# Altium schematic sheet Sheet1.SchDoc
size A1; PageSetup: Record=PageOptions|CenterHorizontal=True|CenterVertical=True|PrintScale=1.00|XCorrection=1.00|YCorrection=1.00|PrintKind=1|BorderSize=5000000|LeftOffset=0|BottomOffset=0|Orientation=2|PaperLength=1000|PaperWidth=1000|Scale=100|PaperSource=7|PrintQuality=-3|MediaType=1|DitherType=10|PrintScaleMode=1|PaperKind=A3 (Scaled)|PaperIndex=8
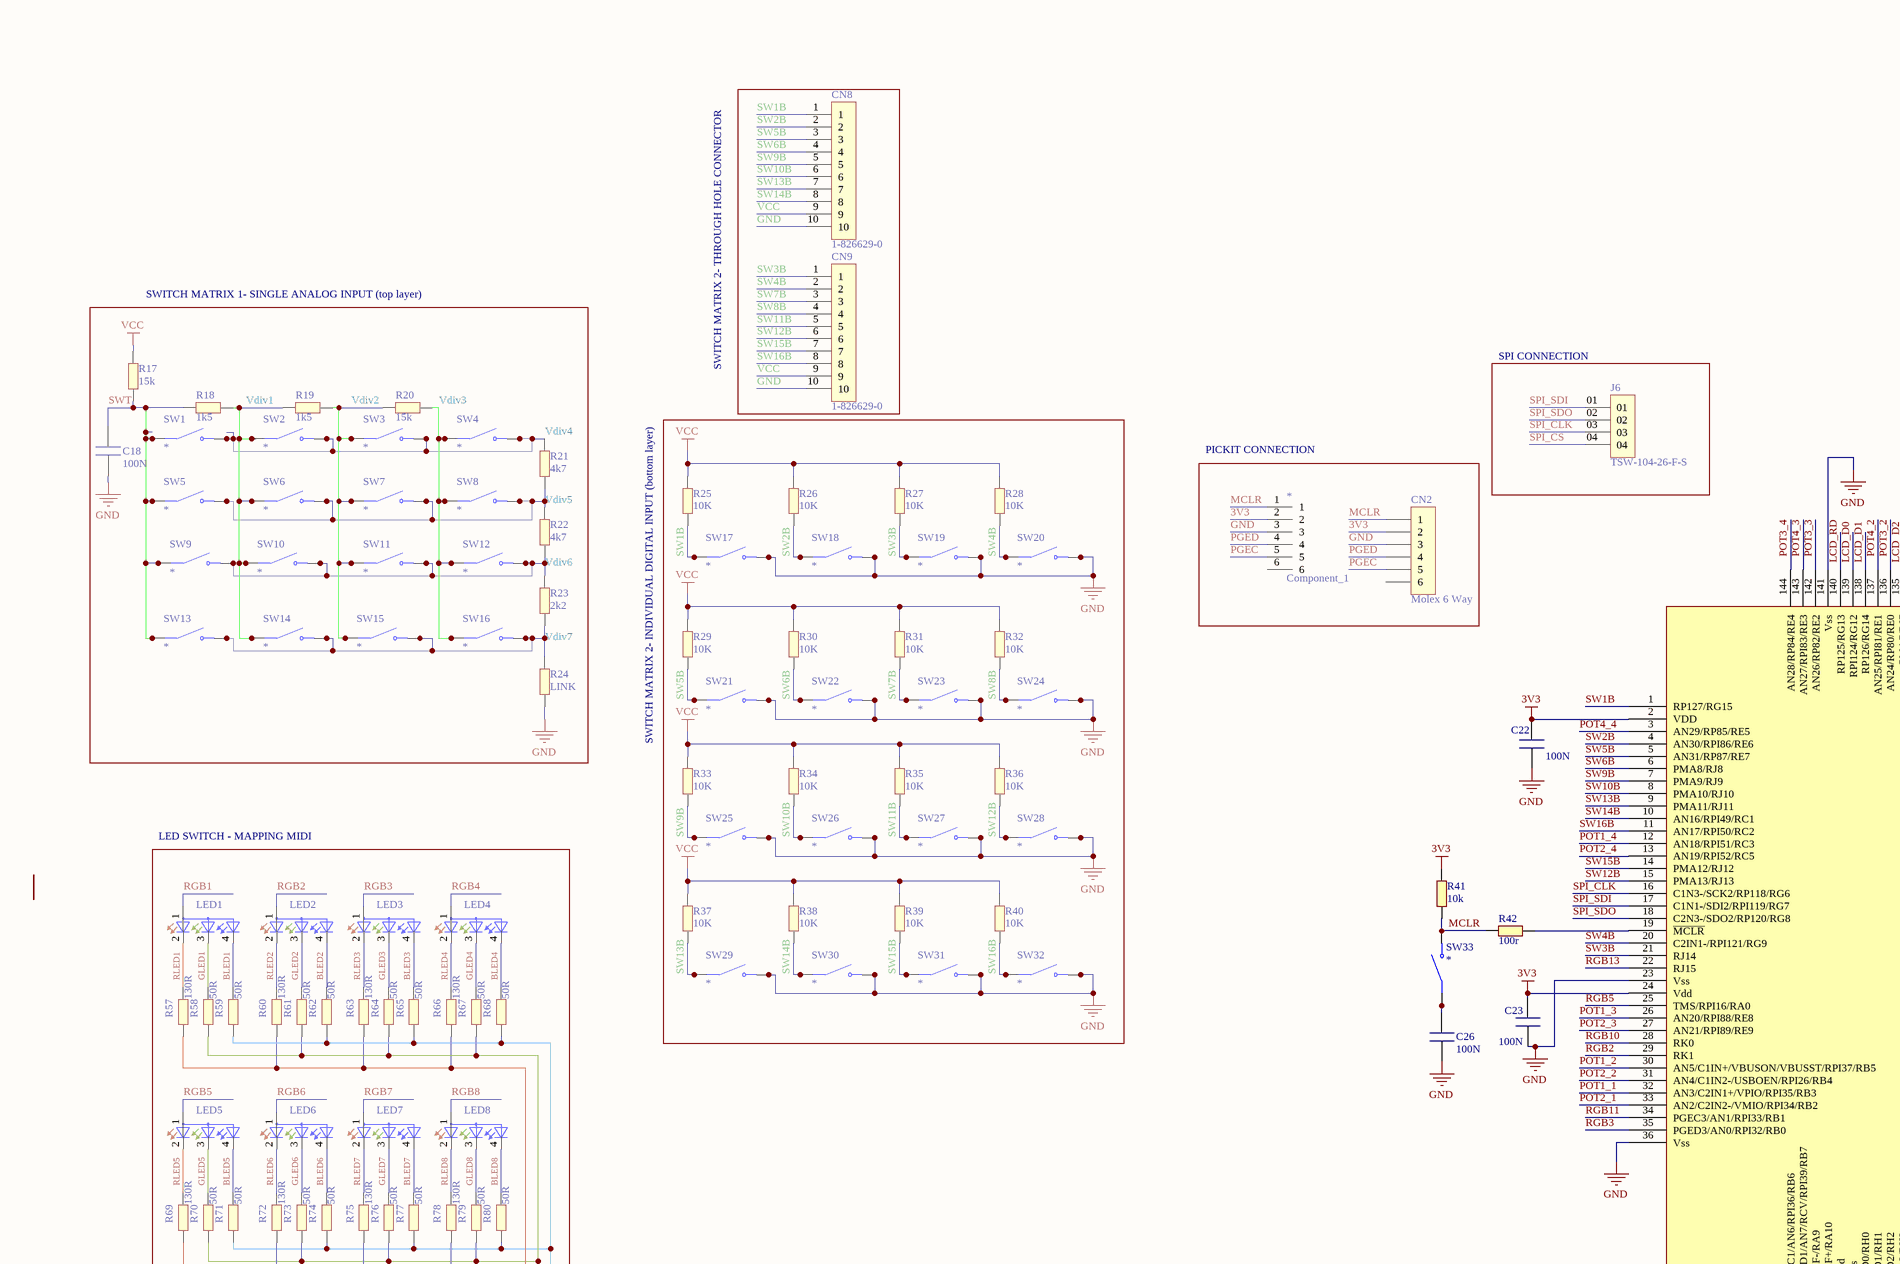
[diagram p0: Sheet1.SchDoc, top left]
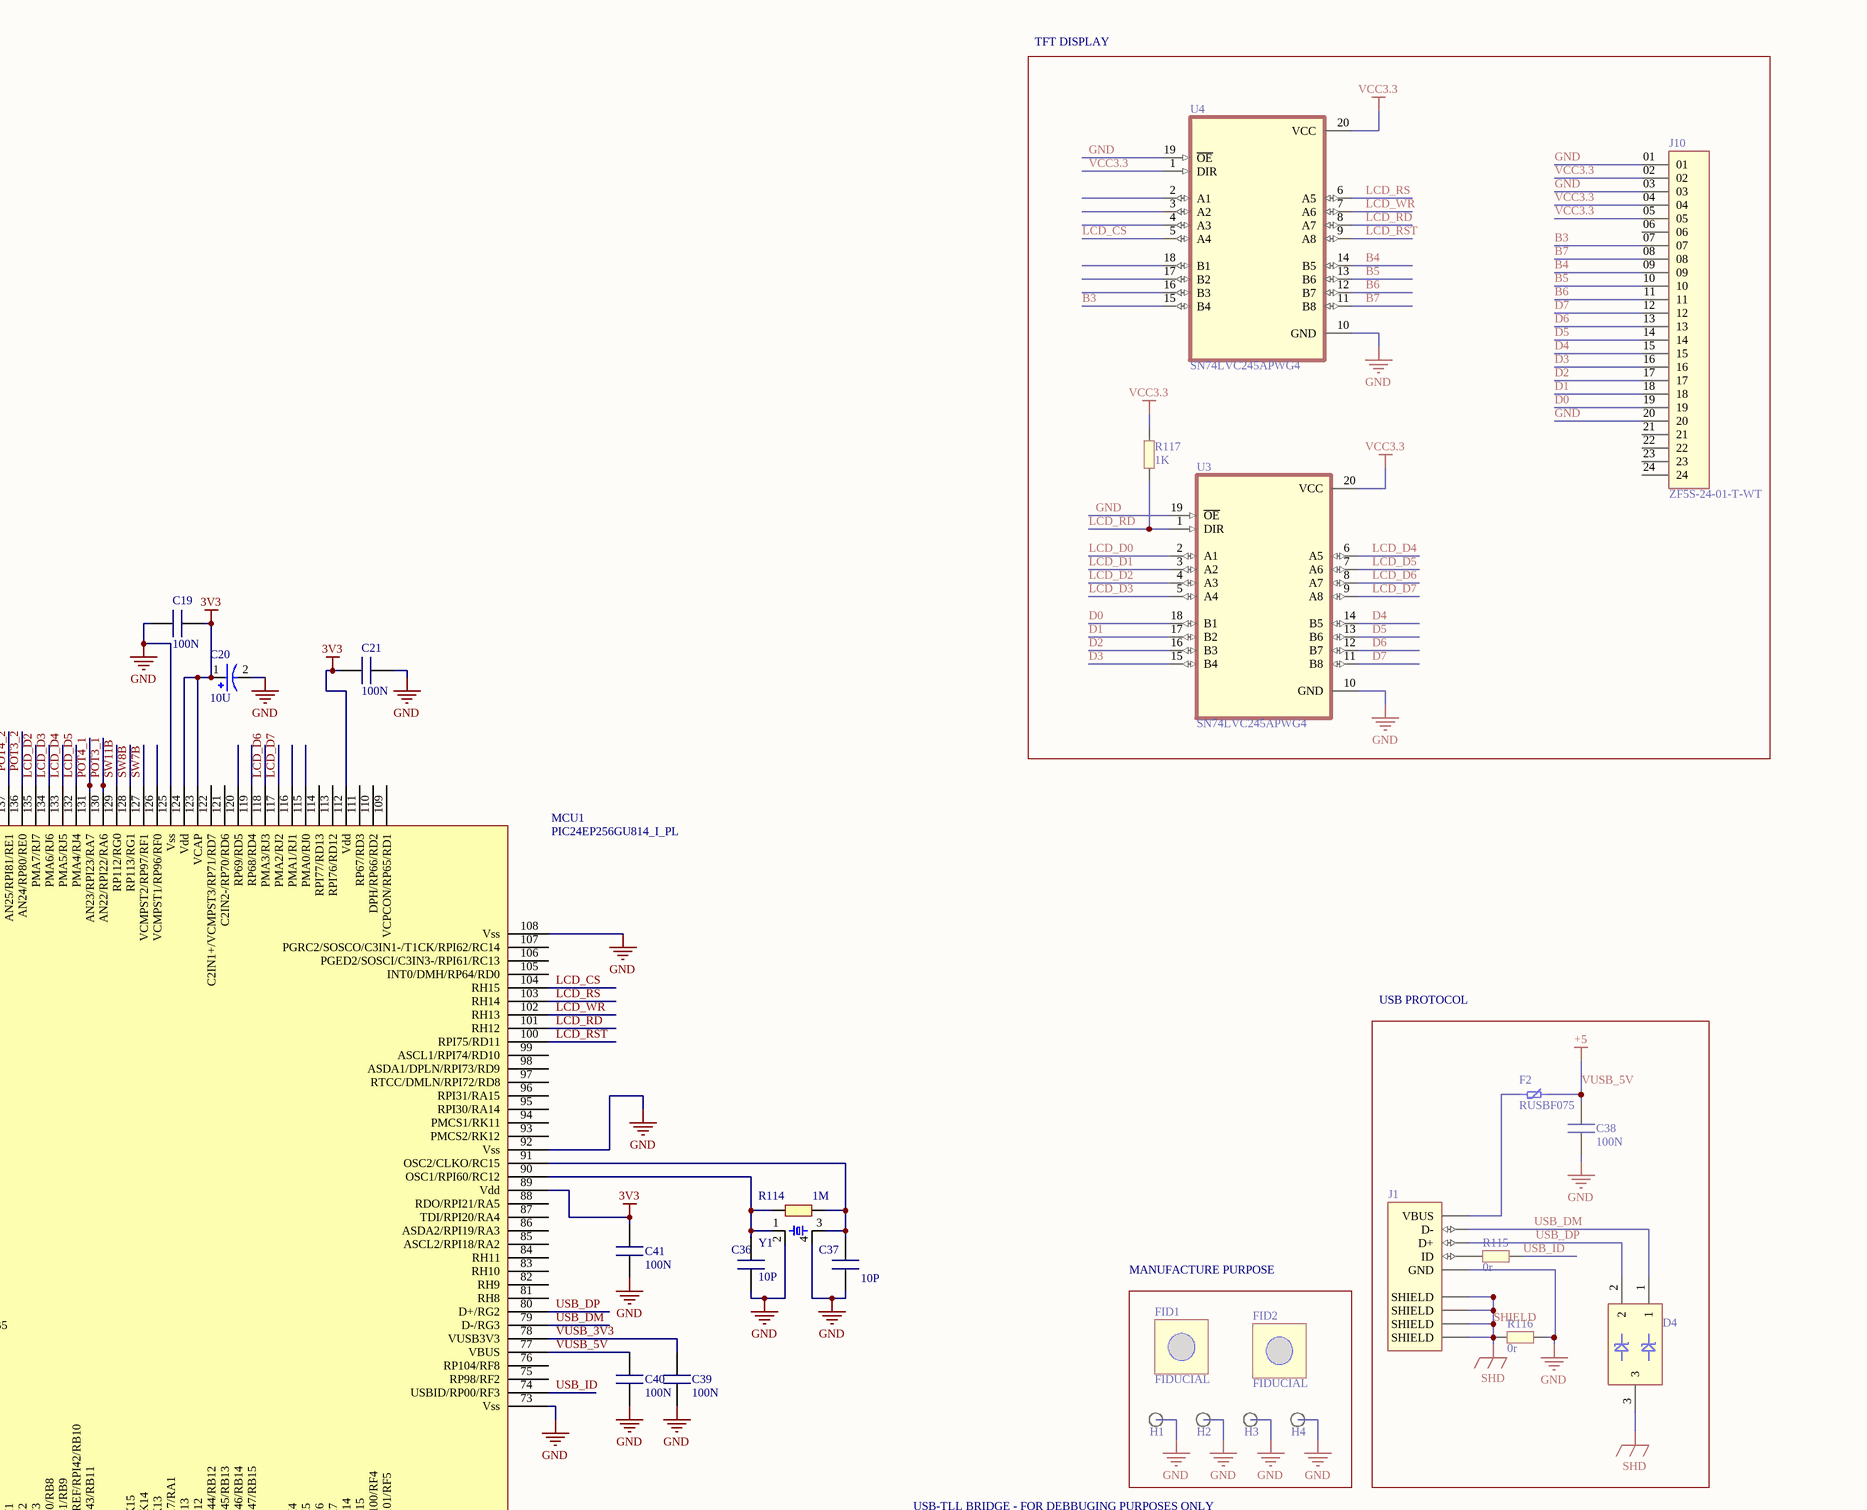
[diagram p1: Sheet1.SchDoc, top right]
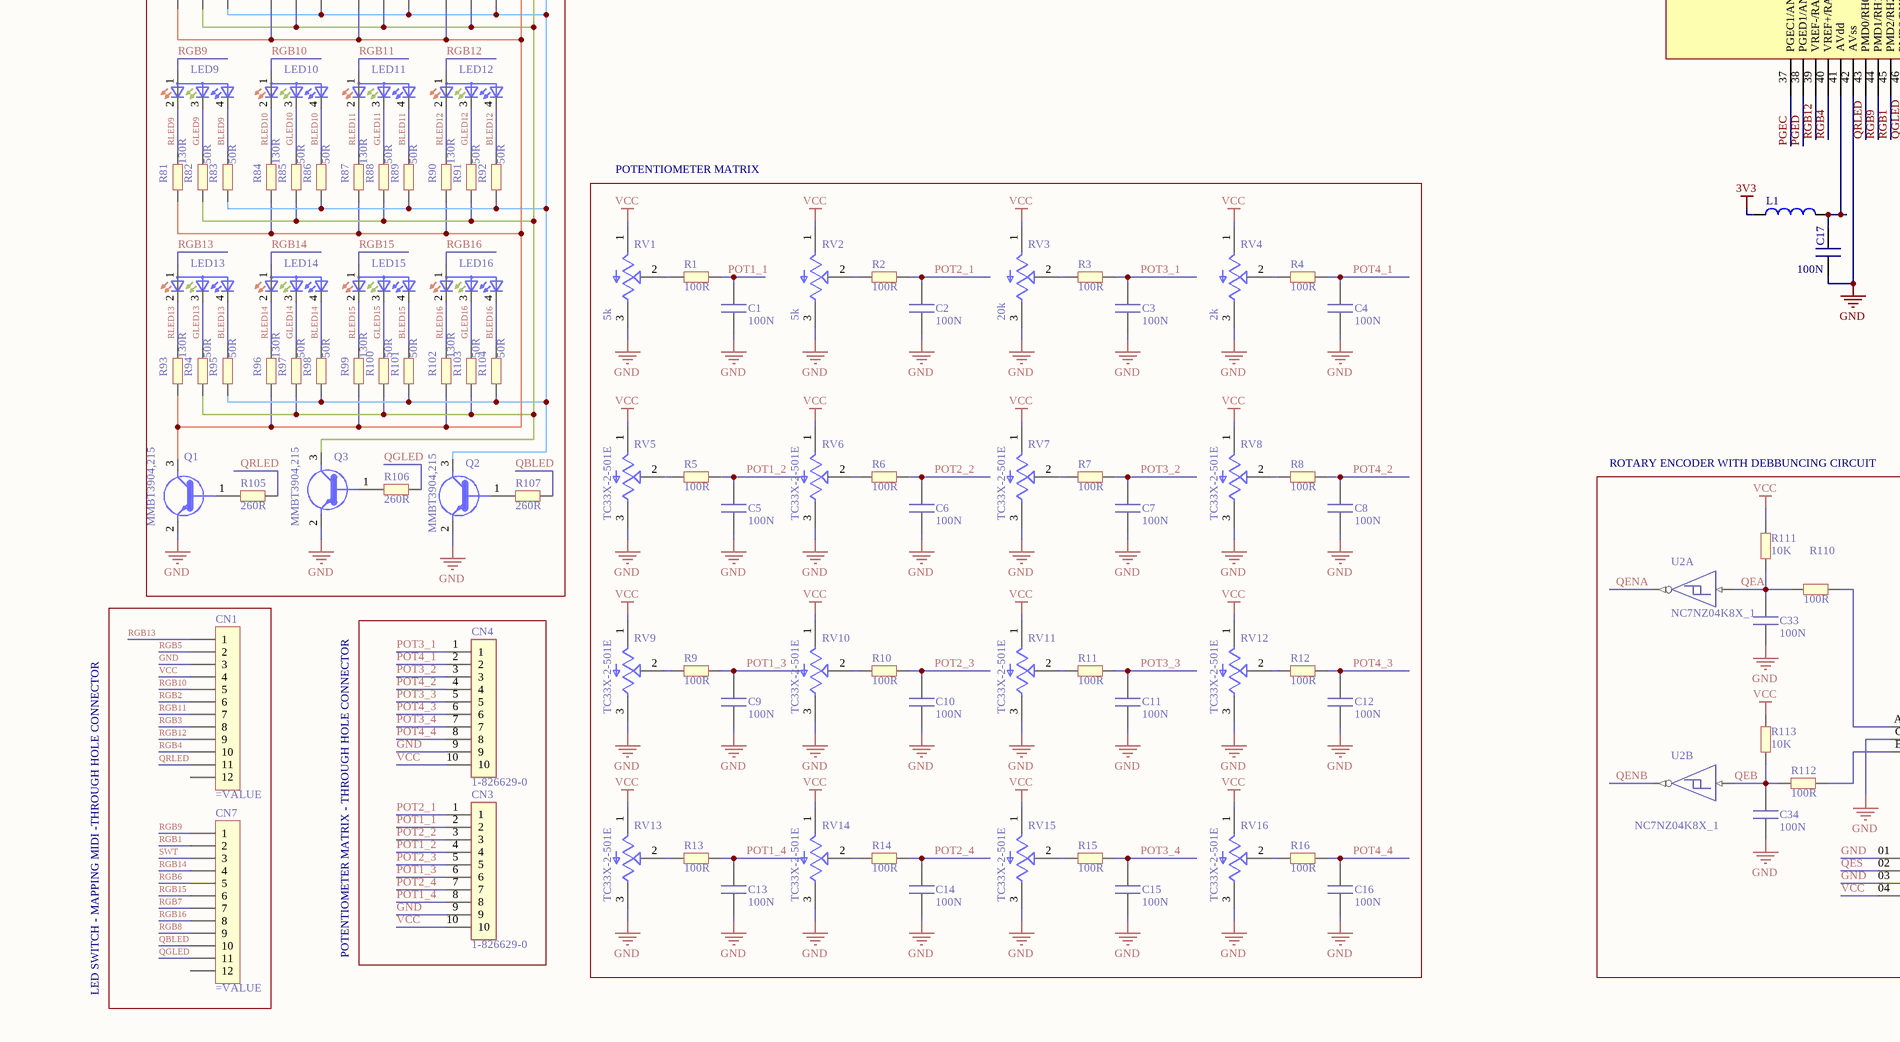
[diagram p2: Sheet1.SchDoc, bottom left]
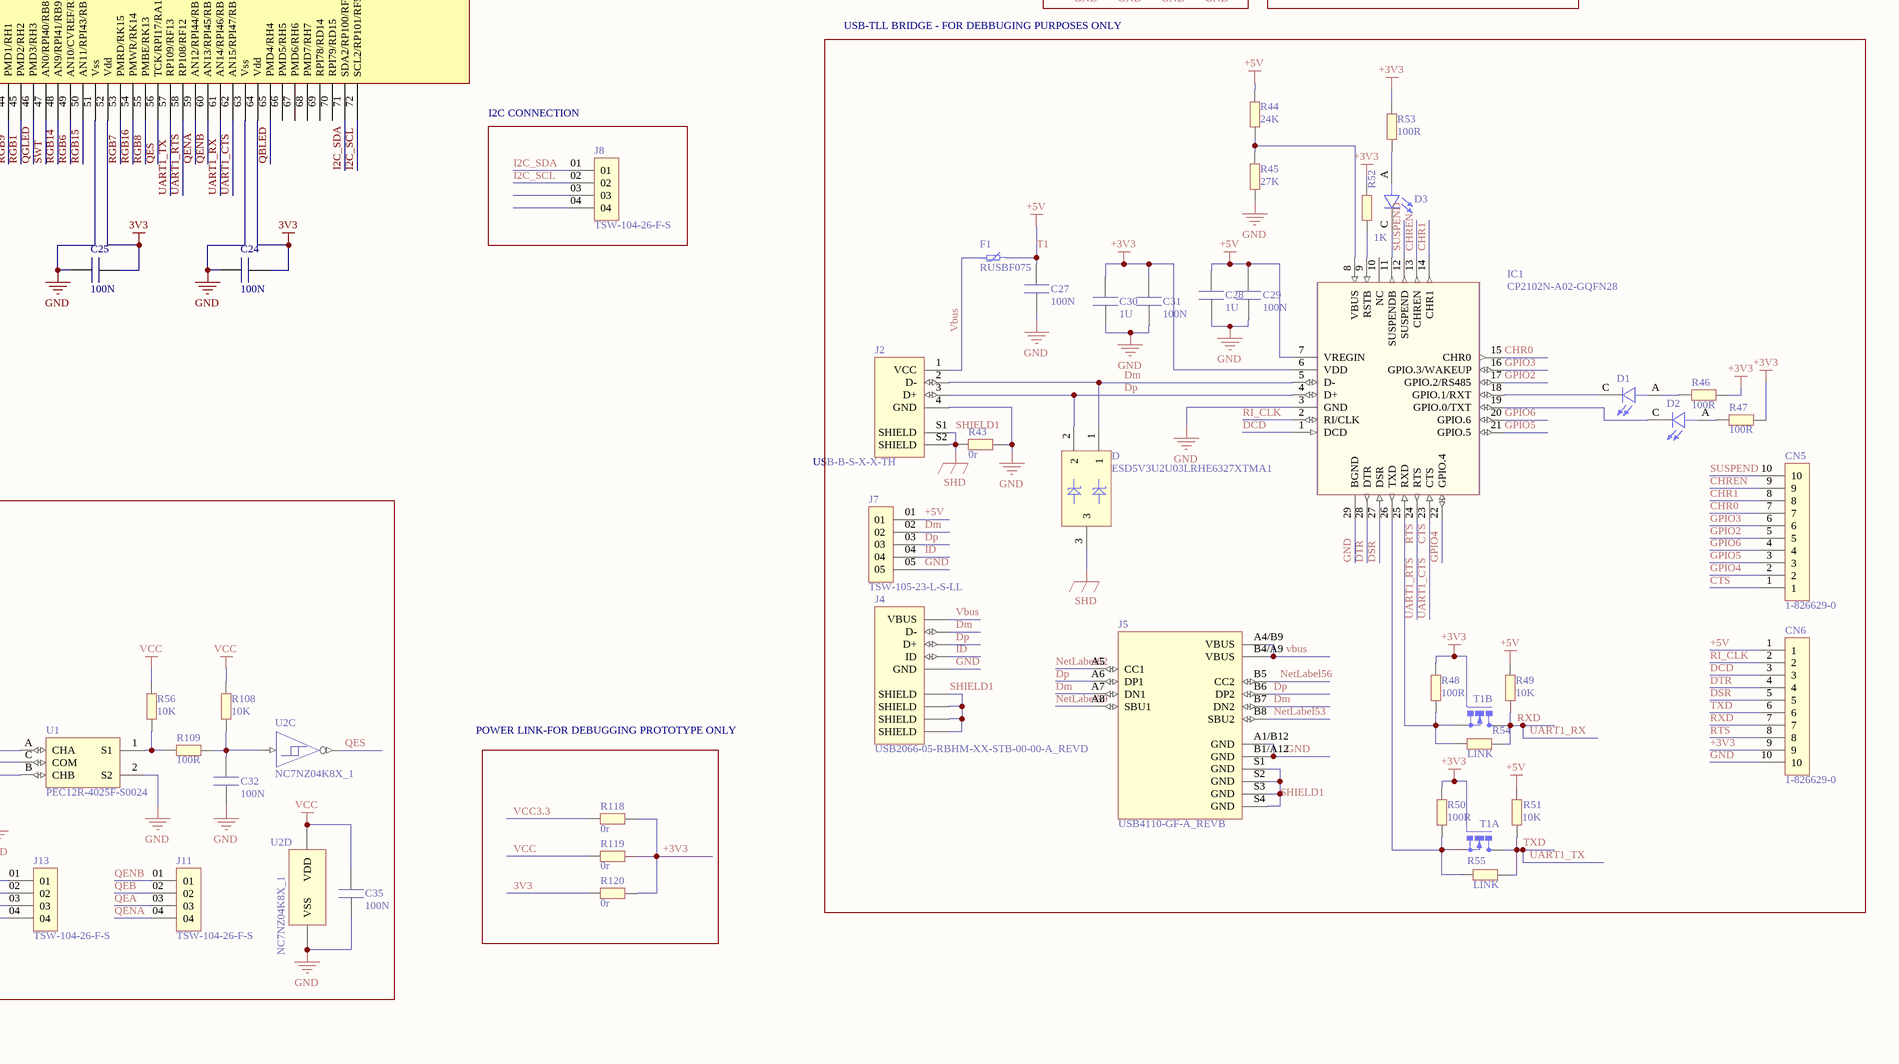
[diagram p3: Sheet1.SchDoc, bottom right]

## Parts
*  Component_1  [0.5_7 - duplicate]
C1  100N  [CAP 0603]
C2  100N  [CAP 0603]
C3  100N  [CAP 0603]
C4  100N  [CAP 0603]
C5  100N  [CAP 0603]
C6  100N  [CAP 0603]
C7  100N  [CAP 0603]
C8  100N  [CAP 0603]
C9  100N  [CAP 0603]
C10  100N  [CAP 0603]
C11  100N  [CAP 0603]
C12  100N  [CAP 0603]
C13  100N  [CAP 0603]
C14  100N  [CAP 0603]
C15  100N  [CAP 0603]
C16  100N  [CAP 0603]
C17  100N  [CAP 0603]
C18  100N  [CAP 0603]
C19  100N  [CAP 0603]
C20  10U  [CAPPM3528X210N]
C21  100N  [CAP 0603]
C22  100N  [CAP 0603]
C23  100N  [CAP 0603]
C24  100N  [CAP 0603]
C25  100N  [CAP 0603]
C26  100N  [CAP 0603]
C27  100N  [CAP 0603]
C28  1U  [CAP 0603]
C29  100N  [CAP 0603]
C30  1U  [CAP 0603]
C31  100N  [CAP 0603]
C32  100N  [CAP 0603]
C33  100N  [CAP 0603]
C34  100N  [CAP 0603]
C35  100N  [CAP 0603]
C36  10P  [CAP 0603]
C37  10P  [CAP 0603]
C38  100N  [CAP 0603]
C39  100N  [CAP 0603]
C40  100N  [CAP 0603]
C41  100N  [CAP 0603]
CN1  (no value)  [Molex 12W]
CN2  Molex 6 Way  [SIL 6 M 90 DEG FLUSH]
CN3  1-826629-0  [TE_1-826629-0]
CN4  1-826629-0  [TE_1-826629-0]
CN5  1-826629-0  [TE_1-826629-0]
CN6  1-826629-0  [TE_1-826629-0]
CN7  (no value)  [Molex 12W]
CN8  1-826629-0  [TE_1-826629-0]
CN9  1-826629-0  [TE_1-826629-0]
D  ESD5V3U2U03LRHE6327XTMA1  [SOT40P120X55-3N]
D1  SML-D12FWT86  [LED_SML-D12FWT86]  (value not drawn)
D2  SML-D12FWT86  [LED_SML-D12FWT86]  (value not drawn)
D3  SML-D12FWT86  [LED_SML-D12FWT86]  (value not drawn)
D4  ESD5V3U2U03LRHE6327XTMA1  [SOT40P120X55-3N]  (value not drawn)
F1  RUSBF075  [RESC1608X50N]
F2  RUSBF075  [RESC1608X50N]
FID1  FIDUCIAL  [FIDUCIAL]
FID2  FIDUCIAL  [FIDUCIAL]
H1  3.0MM HOLE+PAD  [HOLE-3.0MM+PAD]  (value not drawn)
H2  3.0MM HOLE+PAD  [HOLE-3.0MM+PAD]  (value not drawn)
H3  3.0MM HOLE+PAD  [HOLE-3.0MM+PAD]  (value not drawn)
H4  3.0MM HOLE+PAD  [HOLE-3.0MM+PAD]  (value not drawn)
IC1  CP2102N-A02-GQFN28  [QFN50P500X500X80-29N]
J1  USB2066-05-RBHM-XX-STB-00-00-A_REVD  [GCT_USB2066-05-RBHM-XX-STB-00-00-A_REVD]  (value not drawn)
J2  USB-B-S-X-X-TH  [SAMTEC_USB-B-S-X-X-TH]
J4  USB2066-05-RBHM-XX-STB-00-00-A_REVD  [GCT_USB2066-05-RBHM-XX-STB-00-00-A_REVD - NF]
J5  USB4110-GF-A_REVB  [GCT_USB4110-GF-A_REVB]
J6  TSW-104-26-F-S  [SAMTEC_TSW-104-26-F-S]
J7  TSW-105-23-L-S-LL  [SAMTEC_TSW-105-23-L-S-LL]
J8  TSW-104-26-F-S  [SAMTEC_TSW-104-26-F-S]
J10  ZF5S-24-01-T-WT  [SAMTEC_ZF5S-24-01-T-WT]
J11  TSW-104-26-F-S  [SAMTEC_TSW-104-26-F-S]
J13  TSW-104-26-F-S  [SAMTEC_TSW-104-26-F-S]
L1  AIMC-0201-12NJ-T  [INDC0603X95N]  (value not drawn)
LED1  ASMB-KTF0-0A306  [LED_ASMB-KTF0-0A306]  (value not drawn)
LED2  ASMB-KTF0-0A306  [LED_ASMB-KTF0-0A306]  (value not drawn)
LED3  ASMB-KTF0-0A306  [LED_ASMB-KTF0-0A306]  (value not drawn)
LED4  ASMB-KTF0-0A306  [LED_ASMB-KTF0-0A306]  (value not drawn)
LED5  ASMB-KTF0-0A306  [LED_ASMB-KTF0-0A306]  (value not drawn)
LED6  ASMB-KTF0-0A306  [LED_ASMB-KTF0-0A306]  (value not drawn)
LED7  ASMB-KTF0-0A306  [LED_ASMB-KTF0-0A306]  (value not drawn)
LED8  ASMB-KTF0-0A306  [LED_ASMB-KTF0-0A306]  (value not drawn)
LED9  ASMB-KTF0-0A306  [LED_ASMB-KTF0-0A306]  (value not drawn)
LED10  ASMB-KTF0-0A306  [LED_ASMB-KTF0-0A306]  (value not drawn)
LED11  ASMB-KTF0-0A306  [LED_ASMB-KTF0-0A306]  (value not drawn)
LED12  ASMB-KTF0-0A306  [LED_ASMB-KTF0-0A306]  (value not drawn)
LED13  ASMB-KTF0-0A306  [LED_ASMB-KTF0-0A306]  (value not drawn)
LED14  ASMB-KTF0-0A306  [LED_ASMB-KTF0-0A306]  (value not drawn)
LED15  ASMB-KTF0-0A306  [LED_ASMB-KTF0-0A306]  (value not drawn)
LED16  ASMB-KTF0-0A306  [LED_ASMB-KTF0-0A306]  (value not drawn)
MCU1  PIC24EP256GU814_I_PL  [QFP50P2200X2200X160-144N]
Q1  MMBT3904,215  [SOT95P230X110-3N]
Q2  MMBT3904,215  [SOT95P230X110-3N]
Q3  MMBT3904,215  [SOT95P230X110-3N]
R1  100R  [RES 0603]
R2  100R  [RES 0603]
R3  100R  [RES 0603]
R4  100R  [RES 0603]
R5  100R  [RES 0603]
R6  100R  [RES 0603]
R7  100R  [RES 0603]
R8  100R  [RES 0603]
R9  100R  [RES 0603]
R10  100R  [RES 0603]
R11  100R  [RES 0603]
R12  100R  [RES 0603]
R13  100R  [RES 0603]
R14  100R  [RES 0603]
R15  100R  [RES 0603]
R16  100R  [RES 0603]
R17  15k  [RES 0603]
R18  1k5  [RES 0603]
R19  1k5  [RES 0603]
R20  15k  [RES 0603]
R21  4k7  [RES 0603]
R22  4k7  [RES 0603]
R23  2k2  [RES 0603]
R24  LINK  [RES 0603]
R25  10K  [RES 0603]
R26  10K  [RES 0603]
R27  10K  [RES 0603]
R28  10K  [RES 0603]
R29  10K  [RES 0603]
R30  10K  [RES 0603]
R31  10K  [RES 0603]
R32  10K  [RES 0603]
R33  10K  [RES 0603]
R34  10K  [RES 0603]
R35  10K  [RES 0603]
R36  10K  [RES 0603]
R37  10K  [RES 0603]
R38  10K  [RES 0603]
R39  10K  [RES 0603]
R40  10K  [RES 0603]
R41  10k  [RES 0603]
R42  100r  [RES 0603]
R43  0r  [RES 0603]
R44  24K  [RES 0603]
R45  27K  [RES 0603]
R46  100R  [RES 0603]
R47  100R  [RES 0603]
R48  100R  [RES 0603]
R49  10K  [RES 0603]
R50  100R  [RES 0603]
R51  10K  [RES 0603]
R52  1K  [RES 0603]
R53  100R  [RES 0603]
R54  LINK  [RES 0603]
R55  LINK  [RES 0603]
R56  10K  [RES 0603]
R57  130R  [RES 0603]
R58  50R  [RES 0603]
R59  50R  [RES 0603]
R60  130R  [RES 0603]
R61  50R  [RES 0603]
R62  50R  [RES 0603]
R63  130R  [RES 0603]
R64  50R  [RES 0603]
R65  50R  [RES 0603]
R66  130R  [RES 0603]
R67  50R  [RES 0603]
R68  50R  [RES 0603]
R69  130R  [RES 0603]
R70  50R  [RES 0603]
R71  50R  [RES 0603]
R72  130R  [RES 0603]
R73  50R  [RES 0603]
R74  50R  [RES 0603]
R75  130R  [RES 0603]
R76  50R  [RES 0603]
R77  50R  [RES 0603]
R78  130R  [RES 0603]
R79  50R  [RES 0603]
R80  50R  [RES 0603]
R81  130R  [RES 0603]
R82  50R  [RES 0603]
R83  50R  [RES 0603]
R84  130R  [RES 0603]
R85  50R  [RES 0603]
R86  50R  [RES 0603]
R87  130R  [RES 0603]
R88  50R  [RES 0603]
R89  50R  [RES 0603]
R90  130R  [RES 0603]
R91  50R  [RES 0603]
R92  50R  [RES 0603]
R93  130R  [RES 0603]
R94  50R  [RES 0603]
R95  50R  [RES 0603]
R96  130R  [RES 0603]
R97  50R  [RES 0603]
R98  50R  [RES 0603]
R99  130R  [RES 0603]
R100  50R  [RES 0603]
R101  50R  [RES 0603]
R102  130R  [RES 0603]
R103  50R  [RES 0603]
R104  50R  [RES 0603]
R105  260R  [RES 0603]
R106  260R  [RES 0603]
R107  260R  [RES 0603]
R108  10K  [RES 0603]
R109  100R  [RES 0603]
R110  100R  [RES 0603]
R111  10K  [RES 0603]
R112  100R  [RES 0603]
R113  10K  [RES 0603]
R114  1M  [RES 0603]
R115  0r  [RES 0603]
R116  0r  [RES 0603]
R117  1K  [RES 0603]
R118  0r  [RES 0603]
R119  0r  [RES 0603]
R120  0r  [RES 0603]
RV1  5k  [TRIM_TC33X-2-501E]
RV2  5k  [TRIM_TC33X-2-501E]
RV3  20k  [TRIM_TC33X-2-501E]
RV4  2k  [TRIM_TC33X-2-501E]
RV5  TC33X-2-501E  [TRIM_TC33X-2-501E]
RV6  TC33X-2-501E  [TRIM_TC33X-2-501E]
RV7  TC33X-2-501E  [TRIM_TC33X-2-501E]
RV8  TC33X-2-501E  [TRIM_TC33X-2-501E]
RV9  TC33X-2-501E  [TRIM_TC33X-2-501E]
RV10  TC33X-2-501E  [TRIM_TC33X-2-501E]
RV11  TC33X-2-501E  [TRIM_TC33X-2-501E]
RV12  TC33X-2-501E  [TRIM_TC33X-2-501E]
RV13  TC33X-2-501E  [TRIM_TC33X-2-501E]
RV14  TC33X-2-501E  [TRIM_TC33X-2-501E]
RV15  TC33X-2-501E  [TRIM_TC33X-2-501E]
RV16  TC33X-2-501E  [TRIM_TC33X-2-501E]
SW1  KMR731NGLFS  [SW_KMR731NGLFS]  (value not drawn)
SW2  KMR731NGLFS  [SW_KMR731NGLFS]  (value not drawn)
SW3  KMR731NGLFS  [SW_KMR731NGLFS]  (value not drawn)
SW4  KMR731NGLFS  [SW_KMR731NGLFS]  (value not drawn)
SW5  KMR731NGLFS  [SW_KMR731NGLFS]  (value not drawn)
SW6  KMR731NGLFS  [SW_KMR731NGLFS]  (value not drawn)
SW7  KMR731NGLFS  [SW_KMR731NGLFS]  (value not drawn)
SW8  KMR731NGLFS  [SW_KMR731NGLFS]  (value not drawn)
SW9  KMR731NGLFS  [SW_KMR731NGLFS]  (value not drawn)
SW10  KMR731NGLFS  [SW_KMR731NGLFS]  (value not drawn)
SW11  KMR731NGLFS  [SW_KMR731NGLFS]  (value not drawn)
SW12  KMR731NGLFS  [SW_KMR731NGLFS]  (value not drawn)
SW13  KMR731NGLFS  [SW_KMR731NGLFS]  (value not drawn)
SW14  KMR731NGLFS  [SW_KMR731NGLFS]  (value not drawn)
SW15  KMR731NGLFS  [SW_KMR731NGLFS]  (value not drawn)
SW16  KMR731NGLFS  [SW_KMR731NGLFS]  (value not drawn)
SW17  KMR731NGLFS  [SW_KMR731NGLFS]  (value not drawn)
SW18  KMR731NGLFS  [SW_KMR731NGLFS]  (value not drawn)
SW19  KMR731NGLFS  [SW_KMR731NGLFS]  (value not drawn)
SW20  KMR731NGLFS  [SW_KMR731NGLFS]  (value not drawn)
SW21  KMR731NGLFS  [SW_KMR731NGLFS]  (value not drawn)
SW22  KMR731NGLFS  [SW_KMR731NGLFS]  (value not drawn)
SW23  KMR731NGLFS  [SW_KMR731NGLFS]  (value not drawn)
SW24  KMR731NGLFS  [SW_KMR731NGLFS]  (value not drawn)
SW25  KMR731NGLFS  [SW_KMR731NGLFS]  (value not drawn)
SW26  KMR731NGLFS  [SW_KMR731NGLFS]  (value not drawn)
SW27  KMR731NGLFS  [SW_KMR731NGLFS]  (value not drawn)
SW28  KMR731NGLFS  [SW_KMR731NGLFS]  (value not drawn)
SW29  KMR731NGLFS  [SW_KMR731NGLFS]  (value not drawn)
SW30  KMR731NGLFS  [SW_KMR731NGLFS]  (value not drawn)
SW31  KMR731NGLFS  [SW_KMR731NGLFS]  (value not drawn)
SW32  KMR731NGLFS  [SW_KMR731NGLFS]  (value not drawn)
SW33  KMR731NGLFS  [SW_KMR731NGLFS]  (value not drawn)
T1  BSS138PS  [SOT363]  (value not drawn)  (parts A,B of 2)
U1  PEC12R-4025F-S0024  [ENC_PEC12R-4025F-S0024]
U2  NC7NZ04K8X_1  [SOP50P310X90-8N]  (parts A,B,C,D of 4)
U3  SN74LVC245APWG4  [SOP65P640X120-20N]
U4  SN74LVC245APWG4  [SOP65P640X120-20N]
Y1  ABM8G-20.000MHZ-4Y-T3  [OSCSC320X250X100N]  (value not drawn)

## Blocks framed on the sheet
TFT DISPLAY: J10 R117 U3 U4
SWITCH MATRIX 1- SINGLE ANALOG INPUT (top layer): C18 R17-R24 SW1-SW16
SPI CONNECTION: J6
PICKIT CONNECTION: * CN2
USB PROTOCOL: C38 D4 F2 J1 R115 R116
LED SWITCH - MAPPING MIDI: LED1-LED16 Q1-Q3 R57-R107
MANUFACTURE PURPOSE: FID1 FID2 H1-H4
USB-TLL BRIDGE - FOR DEBBUGING PURPOSES ONLY: C27-C31 CN5 CN6 D D1-D3 F1 IC1 J2 J4 J5 J7 R43-R55 T1
I2C CONNECTION: J8
POTENTIOMETER MATRIX: C1-C16 R1-R16 RV1-RV16
ROTARY ENCODER WITH DEBBUNCING CIRCUIT: C32-C35 J11 J13 R56 R108-R113 U1 U2

## Nets
3V3: *.2 C19.2 C20.1 C21.1 C22.2 C23.2 C24.2 C25.2 C41.2 CN2.2 L1.1 MCU1.2(VDD) MCU1.24(Vdd) MCU1.52(Vdd) MCU1.64(Vdd) MCU1.89(Vdd) MCU1.112(Vdd) MCU1.123(VCAP) MCU1.124(Vdd) R41.2 R120.1
+3V3: C30.2 C31.2 CN6.9 IC1.6(VDD) R46.2 R47.2 R48.2 R50.2 R52.2 R53.2 R118.2 R119.2 R120.2 T1.2(G1) T1.5(G2)
+5V: C27.2 C28.2 C29.2 CN6.1 F1.2 IC1.7(VREGIN) J7.01 R44.2 R49.2 R51.2  [also labelled T1]
GND: *.3 C1.1 C2.1 C3.1 C4.1 C5.1 C6.1 C7.1 C8.1 C9.1 C10.1 C11.1 C12.1 C13.1 C14.1 C15.1 C16.1 C17.1 C18.1 C19.1 C20.2 C21.2 C22.1 C23.1 C24.1 C25.1 C26.1 C27.1 C28.1 C29.1 C30.1 C31.1 C32.1 C33.1 C34.1 C35.1 C36.1 C37.1 C38.1 C39.1 C40.1 C41.1 CN1.3 CN2.3 CN3.9 CN4.9 CN6.10 CN8.10 CN9.10 H1.1 H2.1 H3.1 H4.1 IC1.3(GND) IC1.29(BGND) J1.5(GND) J2.4(GND) J4.5(GND) J5.A1/B12(GND) J5.B1/A12(GND) J7.05 J10.01 J10.03 J10.20 J13.01 J13.03 MCU1.23(Vss) MCU1.36(Vss) MCU1.42(AVss) MCU1.51(Vss) MCU1.63(Vss) MCU1.73(Vss) MCU1.92(Vss) MCU1.108(Vss) MCU1.125(Vss) MCU1.141(Vss) Q1.2(E) Q2.2(E) Q3.2(E) R24.1 R43.1 R45.1 R116.1 RV1.3(CW) RV2.3(CW) RV3.3(CW) RV4.3(CW) RV5.3(CW) RV6.3(CW) RV7.3(CW) RV8.3(CW) RV9.3(CW) RV10.3(CW) RV11.3(CW) RV12.3(CW) RV13.3(CW) RV14.3(CW) RV15.3(CW) RV16.3(CW) SW17.1(COM) SW17.4(NO) SW18.1(COM) SW18.4(NO) SW19.1(COM) SW19.4(NO) SW20.1(COM) SW20.4(NO) SW21.1(COM) SW21.4(NO) SW22.1(COM) SW22.4(NO) SW23.1(COM) SW23.4(NO) SW24.1(COM) SW24.4(NO) SW25.1(COM) SW25.4(NO) SW26.1(COM) SW26.4(NO) SW27.1(COM) SW27.4(NO) SW28.1(COM) SW28.4(NO) SW29.1(COM) SW29.4(NO) SW30.1(COM) SW30.4(NO) SW31.1(COM) SW31.4(NO) SW32.1(COM) SW32.4(NO) U1.2(S2) U1.C(COM) U2.4(VSS) U3.10(GND) U3.19(~{OE}) U4.10(GND) U4.19(~{OE}) Y1.2(GND) Y1.4(GND)
SHIELD: D.3 D4.3 J1.6(SHIELD) J1.7(SHIELD) J1.8(SHIELD) J1.9(SHIELD) J2.S1(SHIELD) J2.S2(SHIELD) J4.6(SHIELD) J4.7(SHIELD) J4.8(SHIELD) J4.9(SHIELD) J5.S1(GND) J5.S2(GND) J5.S3(GND) J5.S4(GND) R43.2 R116.2  [also labelled SHD, SHIELD1]
VCC: C35.2 CN1.4 CN3.10 CN4.10 CN8.9 CN9.9 J13.04 R17.2 R25.2 R26.2 R27.2 R28.2 R29.2 R30.2 R31.2 R32.2 R33.2 R34.2 R35.2 R36.2 R37.2 R38.2 R39.2 R40.2 R56.2 R108.1 R111.1 R113.1 R119.1 RV1.1(CCW) RV2.1(CCW) RV3.1(CCW) RV4.1(CCW) RV5.1(CCW) RV6.1(CCW) RV7.1(CCW) RV8.1(CCW) RV9.1(CCW) RV10.1(CCW) RV11.1(CCW) RV12.1(CCW) RV13.1(CCW) RV14.1(CCW) RV15.1(CCW) RV16.1(CCW) U2.8(VDD)
VCC3.3: J10.02 J10.04 J10.05 R117.2 R118.1 U3.20(VCC) U4.1(DIR) U4.20(VCC)
VUSB_5V: C38.2 C40.2 F2.2 MCU1.77(VBUS)  [also labelled +5]
B3: J10.07 U4.15(B4)
B4: J10.09 U4.14(B5)
B5: J10.10 U4.13(B6)
B6: J10.11 U4.12(B7)
B7: J10.08 U4.11(B8)
BLED1: LED1.4(CBLUE) R59.2
BLED2: LED2.4(CBLUE) R62.2
BLED3: LED3.4(CBLUE) R65.2
BLED4: LED4.4(CBLUE) R68.2
BLED5: LED5.4(CBLUE) R71.2
BLED6: LED6.4(CBLUE) R74.2
BLED7: LED7.4(CBLUE) R77.2
BLED8: LED8.4(CBLUE) R80.2
BLED9: LED9.4(CBLUE) R83.2
BLED10: LED10.4(CBLUE) R86.2
BLED11: LED11.4(CBLUE) R89.2
BLED12: LED12.4(CBLUE) R92.2
BLED13: LED13.4(CBLUE) R95.2
BLED14: LED14.4(CBLUE) R98.2
BLED15: LED15.4(CBLUE) R101.2
BLED16: LED16.4(CBLUE) R104.2
CHR0: CN5.7 IC1.15(CHR0)
CHR1: CN5.8 IC1.14(CHR1)
CHREN: CN5.9 IC1.13(CHREN)
CTS: CN5.1 IC1.23(CTS) MCU1.62(AN15/RPI47/RB15)  [also labelled UART1_CTS]
D0: J10.19 U3.18(B1)
D1: J10.18 U3.17(B2)
D2: J10.17 U3.16(B3)
D3: J10.16 U3.15(B4)
D4: J10.15 U3.14(B5)
D5: J10.14 U3.13(B6)
D6: J10.13 U3.12(B7)
D7: J10.12 U3.11(B8)
DCD: CN6.3 IC1.1(DCD)
Dm: D.1 IC1.5(D-) J2.2(D-) J4.2(D-) J5.A7(DN1) J5.B7(DN2) J7.02
Dp: D.2 IC1.4(D+) J2.3(D+) J4.3(D+) J5.A6(DP1) J5.B6(DP2) J7.03
DSR: CN6.5 IC1.27(DSR)
DTR: CN6.4 IC1.28(DTR)
GLED1: LED1.3(CGREEN) R58.2
GLED2: LED2.3(CGREEN) R61.2
GLED3: LED3.3(CGREEN) R64.2
GLED4: LED4.3(CGREEN) R67.2
GLED5: LED5.3(CGREEN) R70.2
GLED6: LED6.3(CGREEN) R73.2
GLED7: LED7.3(CGREEN) R76.2
GLED8: LED8.3(CGREEN) R79.2
GLED9: LED9.3(CGREEN) R82.2
GLED10: LED10.3(CGREEN) R85.2
GLED11: LED11.3(CGREEN) R88.2
GLED12: LED12.3(CGREEN) R91.2
GLED13: LED13.3(CGREEN) R94.2
GLED14: LED14.3(CGREEN) R97.2
GLED15: LED15.3(CGREEN) R100.2
GLED16: LED16.3(CGREEN) R103.2
GPIO2: CN5.5 IC1.17(GPIO.2/RS485)
GPIO3: CN5.6 IC1.16(GPIO.3/WAKEUP)
GPIO4: CN5.2 IC1.22(GPIO.4)
GPIO5: CN5.3 IC1.21(GPIO.5)
GPIO6: CN5.4 IC1.20(GPIO.6)
I2C_SCL: J8.02 MCU1.72(SCL2/RP101/RF5)
I2C_SDA: J8.01 MCU1.71(SDA2/RP100/RF4)
ID: J4.4(ID) J7.04
LCD_CS: MCU1.104(RH15) U4.5(A4)
LCD_D0: MCU1.139(RPI124/RG12) U3.2(A1)
LCD_D1: MCU1.138(RP126/RG14) U3.3(A2)
LCD_D2: MCU1.135(PMA7/RJ7) U3.4(A3)
LCD_D3: MCU1.134(PMA6/RJ6) U3.5(A4)
LCD_D4: MCU1.133(PMA5/RJ5) U3.6(A5)
LCD_D5: MCU1.132(PMA4/RJ4) U3.7(A6)
LCD_D6: MCU1.118(PMA3/RJ3) U3.8(A7)
LCD_D7: MCU1.117(PMA2/RJ2) U3.9(A8)
LCD_RD: MCU1.101(RH12) MCU1.140(RP125/RG13) R117.1 U3.1(DIR) U4.8(A7)
LCD_RS: MCU1.103(RH14) U4.6(A5)
LCD_RST: MCU1.100(RPI75/RD11) U4.9(A8)
LCD_WR: MCU1.102(RH13) U4.7(A6)
MCLR: *.1 CN2.1 R41.1 R42.1 SW33.1(NO) SW33.2(NO)
NetLabel53: J5.B8(SBU2)
NetLabel56: J5.B5(CC2)
NetLabel59: J5.A8(SBU1)
NetLabel62: J5.A5(CC1)
PGEC: *.5 CN2.5 MCU1.37(PGEC1/AN6/RPI36/RB6)
PGED: *.4 CN2.4 MCU1.38(PGED1/AN7/RCV/RPI39/RB7)
POT1_1: C1.2 CN3.2 MCU1.32(AN3/C2IN1+/VPIO/RPI35/RB3) R1.2
POT1_2: C5.2 CN3.4 MCU1.30(AN5/C1IN+/VBUSON/VBUSST/RPI37/RB5) R5.2
POT1_3: C9.2 CN3.6 MCU1.26(AN20/RPI88/RE8) R9.2
POT1_4: C13.2 CN3.8 MCU1.12(AN18/RPI51/RC3) R13.2
POT2_1: C2.2 CN3.1 MCU1.33(AN2/C2IN2-/VMIO/RPI34/RB2) R2.2
POT2_2: C6.2 CN3.3 MCU1.31(AN4/C1IN2-/USBOEN/RPI26/RB4) R6.2
POT2_3: C10.2 CN3.5 MCU1.27(AN21/RPI89/RE9) R10.2
POT2_4: C14.2 CN3.7 MCU1.13(AN19/RPI52/RC5) R14.2
POT3_1: C3.2 CN4.1 MCU1.130(AN22/RPI22/RA6) R3.2
POT3_2: C7.2 CN4.3 MCU1.136(AN24/RP80/RE0) R7.2
POT3_3: C11.2 CN4.5 MCU1.142(AN26/RP82/RE2) R11.2
POT3_4: C15.2 CN4.7 MCU1.144(AN28/RP84/RE4) R15.2
POT4_1: C4.2 CN4.2 MCU1.131(AN23/RPI23/RA7) R4.2
POT4_2: C8.2 CN4.4 MCU1.137(AN25/RPI81/RE1) R8.2
POT4_3: C12.2 CN4.6 MCU1.143(AN27/RPI83/RE3) R12.2
POT4_4: C16.2 CN4.8 MCU1.3(AN29/RP85/RE5) R16.2
QBLED: CN7.10 MCU1.65(PMD4/RH4) R107.2
QEA: C33.2 J11.03 R110.1 R111.2 U2.1(1A)
QEB: C34.2 J11.02 R112.1 R113.2 U2.3(2A)
QENA: J11.04 MCU1.59(AN12/RPI44/RB12) U2.7(1Y)
QENB: J11.01 MCU1.60(AN13/RPI45/RB13) U2.5(2Y)
QES: J13.02 MCU1.56(TCK/RPI17/RA1) U2.2(3Y)
QGLED: CN7.11 MCU1.46(PMD3/RH3) R106.2
QRLED: CN1.11 MCU1.43(PMD0/RH0) R105.2
RGB1: CN7.2 LED1.1(A) MCU1.45(PMD2/RH2)
RGB2: CN1.6 LED2.1(A) MCU1.29(RK1)
RGB3: CN1.8 LED3.1(A) MCU1.35(PGED3/AN0/RPI32/RB0)
RGB4: CN1.10 LED4.1(A) MCU1.40(VREF+/RA10)
RGB5: CN1.2 LED5.1(A) MCU1.25(TMS/RPI16/RA0)
RGB6: CN7.5 LED6.1(A) MCU1.49(AN10/CVREF/RPI42/RB10)
RGB7: CN7.7 LED7.1(A) MCU1.53(PMRD/RK15)
RGB8: CN7.9 LED8.1(A) MCU1.55(PMBE/RK13)
RGB9: CN7.1 LED9.1(A) MCU1.44(PMD1/RH1)
RGB10: CN1.5 LED10.1(A) MCU1.28(RK0)
RGB11: CN1.7 LED11.1(A) MCU1.34(PGEC3/AN1/RPI33/RB1)
RGB12: CN1.9 LED12.1(A) MCU1.39(VREF-/RA9)
RGB13: CN1.1 LED13.1(A) MCU1.22(RJ15)
RGB14: CN7.4 LED14.1(A) MCU1.48(AN9/RPI41/RB9)
RGB15: CN7.6 LED15.1(A) MCU1.50(AN11/RPI43/RB11)
RGB16: CN7.8 LED16.1(A) MCU1.54(PMWR/RK14)
RI_CLK: CN6.2 IC1.2(RI/CLK)
RLED1: LED1.2(CRED) R57.2
RLED2: LED2.2(CRED) R60.2
RLED3: LED3.2(CRED) R63.2
RLED4: LED4.2(CRED) R66.2
RLED5: LED5.2(CRED) R69.2
RLED6: LED6.2(CRED) R72.2
RLED7: LED7.2(CRED) R75.2
RLED8: LED8.2(CRED) R78.2
RLED9: LED9.2(CRED) R81.2
RLED10: LED10.2(CRED) R84.2
RLED11: LED11.2(CRED) R87.2
RLED12: LED12.2(CRED) R90.2
RLED13: LED13.2(CRED) R93.2
RLED14: LED14.2(CRED) R96.2
RLED15: LED15.2(CRED) R99.2
RLED16: LED16.2(CRED) R102.2
RTS: CN6.8 IC1.24(RTS) MCU1.58(RP108/RF12)  [also labelled UART1_RTS]
RXD: CN6.7 MCU1.61(AN14/RPI46/RB14) R49.1 R54.2 T1.3(D2)  [also labelled UART1_RX]
SPI_CLK: J6.03 MCU1.16(C1N3-/SCK2/RP118/RG6)
SPI_CS: J6.04
SPI_SDI: J6.01 MCU1.17(C1N1-/SDI2/RPI119/RG7)
SPI_SDO: J6.02 MCU1.18(C2N3-/SDO2/RP120/RG8)
SUSPEND: CN5.10 IC1.12(SUSPEND)
SW1B: CN8.1 MCU1.1(RP127/RG15) R25.1 SW17.2(COM) SW17.3(NO)
SW2B: CN8.2 MCU1.4(AN30/RPI86/RE6) R26.1 SW18.2(COM) SW18.3(NO)
SW3B: CN9.1 MCU1.21(RJ14) R27.1 SW19.2(COM) SW19.3(NO)
SW4B: CN9.2 MCU1.20(C2IN1-/RPI121/RG9) R28.1 SW20.2(COM) SW20.3(NO)
SW5B: CN8.3 MCU1.5(AN31/RP87/RE7) R29.1 SW21.2(COM) SW21.3(NO)
SW6B: CN8.4 MCU1.6(PMA8/RJ8) R30.1 SW22.2(COM) SW22.3(NO)
SW7B: CN9.3 MCU1.127(VCMPST2/RP97/RF1) R31.1 SW23.2(COM) SW23.3(NO)
SW8B: CN9.4 MCU1.128(RP113/RG1) R32.1 SW24.2(COM) SW24.3(NO)
SW9B: CN8.5 MCU1.7(PMA9/RJ9) R33.1 SW25.2(COM) SW25.3(NO)
SW10B: CN8.6 MCU1.8(PMA10/RJ10) R34.1 SW26.2(COM) SW26.3(NO)
SW11B: CN9.5 MCU1.129(RP112/RG0) R35.1 SW27.2(COM) SW27.3(NO)
SW12B: CN9.6 MCU1.15(PMA13/RJ13) R36.1 SW28.2(COM) SW28.3(NO)
SW13B: CN8.7 MCU1.9(PMA11/RJ11) R37.1 SW29.2(COM) SW29.3(NO)
SW14B: CN8.8 MCU1.10(AN16/RPI49/RC1) R38.1 SW30.2(COM) SW30.3(NO)
SW15B: CN9.7 MCU1.14(PMA12/RJ12) R39.1 SW31.2(COM) SW31.3(NO)
SW16B: CN9.8 MCU1.11(AN17/RPI50/RC2) R40.1 SW32.2(COM) SW32.3(NO)
SWT: C18.2 CN7.3 MCU1.47(AN0/RPI40/RB8) R17.1 R18.1 SW1.2(COM) SW1.3(NO) SW5.2(COM) SW5.3(NO) SW9.2(COM) SW9.3(NO) SW13.2(COM) SW13.3(NO)
TXD: CN6.6 MCU1.57(RP109/RF13) R51.1 R55.2 T1.6(D1)  [also labelled UART1_TX]
USB_DM: D4.1 J1.2(D-) MCU1.79(D-/RG3)
USB_DP: D4.2 J1.3(D+) MCU1.80(D+/RG2)
USB_ID: MCU1.74(USBID/RP00/RF3) R115.1
Vbus: F1.1 J2.1(VCC) J4.1(VBUS) J5.A4/B9(VBUS) J5.B4/A9(VBUS)
Vdiv1: R18.2 R19.1 SW2.2(COM) SW2.3(NO) SW6.2(COM) SW6.3(NO) SW10.2(COM) SW10.3(NO) SW14.2(COM) SW14.3(NO)
Vdiv2: R19.2 R20.1 SW3.2(COM) SW3.3(NO) SW7.2(COM) SW7.3(NO) SW11.2(COM) SW11.3(NO) SW15.2(COM) SW15.3(NO)
Vdiv3: R20.2 SW4.2(COM) SW4.3(NO) SW8.2(COM) SW8.3(NO) SW12.2(COM) SW12.3(NO) SW16.2(COM) SW16.3(NO)
Vdiv4: R21.2 SW1.1(COM) SW1.4(NO) SW2.1(COM) SW2.4(NO) SW3.1(COM) SW3.4(NO) SW4.1(COM) SW4.4(NO)
Vdiv5: R21.1 R22.2 SW5.1(COM) SW5.4(NO) SW6.1(COM) SW6.4(NO) SW7.1(COM) SW7.4(NO) SW8.1(COM) SW8.4(NO)
Vdiv6: R22.1 R23.2 SW9.1(COM) SW9.4(NO) SW10.1(COM) SW10.4(NO) SW11.1(COM) SW11.4(NO) SW12.1(COM) SW12.4(NO)
Vdiv7: R23.1 R24.2 SW13.1(COM) SW13.4(NO) SW14.1(COM) SW14.4(NO) SW15.1(COM) SW15.4(NO) SW16.1(COM) SW16.4(NO)
VUSB_3V3: C39.2 MCU1.78(VUSB3V3)
NetC17_2: C17.2 L1.2 MCU1.41(AVdd)
NetC26_2: C26.2 SW33.3(COM) SW33.4(COM)
NetC32_2: C32.2 R108.2 R109.1 U2.6(3A)
NetC36_2: C36.2 MCU1.90(OSC1/RPI60/RC12) R114.1 Y1.1
NetC37_2: C37.2 MCU1.91(OSC2/CLKO/RC15) R114.2 Y1.3
NetD1_A: D1.A R46.1
NetD1_C: D1.C IC1.18(GPIO.1/RXT)
NetD2_A: D2.A R47.1
NetD2_C: D2.C IC1.19(GPIO.0/TXT)
NetD3_A: D3.A R53.1
NetD3_C: D3.C IC1.11(SUSPENDB)
NetF2_1: F2.1 J1.1(VBUS)
NetIC1_8: IC1.8(VBUS) R44.1 R45.2
NetIC1_9: IC1.9(RSTB) R52.1
NetIC1_25: IC1.25(RXD) R48.1 R54.1 T1.4(S2)
NetIC1_26: IC1.26(TXD) R50.1 R55.1 T1.1(S1)
NetJ1_4: J1.4(ID) R115.2
NetMCU1_19: MCU1.19(~{MCLR}) R42.2
NetQ1_1: Q1.1(B) R105.1
NetQ1_3: Q1.3(C) R57.1 R60.1 R63.1 R66.1 R69.1 R72.1 R75.1 R78.1 R81.1 R84.1 R87.1 R90.1 R93.1 R96.1 R99.1 R102.1
NetQ2_1: Q2.1(B) R107.1
NetQ2_3: Q2.3(C) R59.1 R62.1 R65.1 R68.1 R71.1 R74.1 R77.1 R80.1 R83.1 R86.1 R89.1 R92.1 R95.1 R98.1 R101.1 R104.1
NetQ3_1: Q3.1(B) R106.1
NetQ3_3: Q3.3(C) R58.1 R61.1 R64.1 R67.1 R70.1 R73.1 R76.1 R79.1 R82.1 R85.1 R88.1 R91.1 R94.1 R97.1 R100.1 R103.1
NetR1_1: R1.1 RV1.2(W)
NetR2_1: R2.1 RV2.2(W)
NetR3_1: R3.1 RV3.2(W)
NetR4_1: R4.1 RV4.2(W)
NetR5_1: R5.1 RV5.2(W)
NetR6_1: R6.1 RV6.2(W)
NetR7_1: R7.1 RV7.2(W)
NetR8_1: R8.1 RV8.2(W)
NetR9_1: R9.1 RV9.2(W)
NetR10_1: R10.1 RV10.2(W)
NetR11_1: R11.1 RV11.2(W)
NetR12_1: R12.1 RV12.2(W)
NetR13_1: R13.1 RV13.2(W)
NetR14_1: R14.1 RV14.2(W)
NetR15_1: R15.1 RV15.2(W)
NetR16_1: R16.1 RV16.2(W)
NetR56_1: R56.1 R109.2 U1.1(S1)
NetR110_2: R110.2 U1.A(CHA)
NetR112_2: R112.2 U1.B(CHB)

Not connected (* = marked no-connect by the designer): * 6; CN1 12; CN2 6; CN7 12; IC1 10(NC); J8 03 04; J10 06 21 22 23 24; MCU1 66(PMD5/RH5) 67(PMD6/RH6) 68(PMD7/RH7) 69(RPI78/RD14) 70(RPI79/RD15) 75(RP98/RF2) 76(RP104/RF8) 81(RH8) 82(RH9) 83(RH10) 84(RH11) 85(ASCL2/RPI18/RA2) 86(ASDA2/RPI19/RA3) 87(TDI/RPI20/RA4) 88(RDO/RPI21/RA5) 93(PMCS2/RK12) 94(PMCS1/RK11) 95(RPI30/RA14) 96(RPI31/RA15) 97(RTCC/DMLN/RPI72/RD8) 98(ASDA1/DPLN/RPI73/RD9) 99(ASCL1/RPI74/RD10) 105(INT0/DMH/RP64/RD0) 106(PGED2/SOSCI/C3IN3-/RPI61/RC13) 107(PGRC2/SOSCO/C3IN1-/T1CK/RPI62/RC14) 109(VCPCON/RP65/RD1) 110(DPH/RP66/RD2) 111(RP67/RD3) 113(RPI76/RD12) 114(RPI77/RD13) 115(PMA0/RJ0) 116(PMA1/RJ1) 119(RP68/RD4) 120(RP69/RD5) 121(C2IN2-/RP70/RD6) 122(C2IN1+/VCMPST3/RP71/RD7) 126(VCMPST1/RP96/RF0); U4 2(A1) 3(A2) 4(A3) 16(B3) 17(B2) 18(B1)

## Notes on the sheet
- SWITCH MATRIX 2- THROUGH HOLE CONNECTOR
- SWITCH MATRIX 2- INDIVIDUAL DIGITAL INPUT (bottom layer)
- POWER LINK-FOR DEBUGGING PROTOTYPE ONLY
- POTENTIOMETER MATRIX - THROUGH HOLE CONNECTOR
- LED SWITCH - MAPPING MIDI -THROUGH HOLE CONNECTOR

## Library data of the parts
C1-C19 C21-C41 = CAP 0603: Standard 0603 Capacitor; Footprint: 0805
  C1-C16 C18: Value: 100N
C20 = T494B106M010AT: 10ÂµF Molded Tantalum Capacitors 20V 1206 (3216 Metric) 5Ohm; MF: KEMET; MP: T491A106K020AT; Purchase-URL: https://pricing.snapeda.com/search/part/T491A106K020AT/?ref=eda; Package: 1206 KEMET; Check_prices: https://www.snapeda.com/parts/T491A106K020AT/KEMET/view-part/1755094/?ref=eda; Digi-Key_Part_Number: 399-18019-1-ND; Value: *; SnapEDA_Link: https://www.snapeda.com/parts/T491A106K020AT/KEMET/view-part/1755094/?ref=snap
CN1 CN7 = Molex 12W Fem
CN2 = Molex 6W 90M
CN3-CN6 CN8 CN9 = 1-826629-0: Conn Unshrouded Header HDR 10 POS 2.54mm Solder ST Thru-Hole Carton; MF: TE Connectivity; Value: *; Availability: Unavailable; Price: None; Package: None; MP: 1-826629-0; SnapEDA_Link: https://www.snapeda.com/parts/1-826629-0/TE%20Connectivity%20AMP%20Connectors/view-part/2877207/?ref=snap
D D4 = ESD5V3U2U03LRHE6327XTMA1: Ultra-Low Capacitance ESD Diode Array; MF: Infineon; Value: *; SnapEDA_Link: https://www.snapeda.com/parts/ESD5V3U2U03LRHE6327XTMA1/Infineon%20Technologies/view-part/448208/?ref=snap; MP: ESD5V3U2U03LRHE6327XTMA1; Digi-Key_Part_Number: ESD5V3U2U03LRHE6327XTMA1CT-ND; Mouser-Purchase-URL: https://snapeda.com/shop?store=Mouser&id=448208; Package: SOT-883 Infineon
D1-D3 = SML-D12FWT86: Green 565nm LED Indication - Discrete 2.2V 0603 (1608 Metric); MF: Rohm; Check_prices: https://www.snapeda.com/parts/SML-D12FWT86/Rohm/view-part/2753923/?ref=eda; Package: 0603 Rohm; Price: None; Value: *; MP: SML-D12FWT86; SnapEDA_Link: https://www.snapeda.com/parts/SML-D12FWT86/Rohm/view-part/2753923/?ref=snap; Availability: Good; Purchase-URL: https://pricing.snapeda.com/search/part/SML-D12FWT86/?ref=eda
F1 F2 = RUSBF075: PTC Resettable Fuse 0.75A(hold) 1.3A(trip) 6V 0.3W 0.4s 0.11Ohm Radial 6.9 X 3.1mm Bulk; MF: TE Connectivity; Check_prices: https://www.snapeda.com/parts/RUSBF075/TE%20Connectivity/view-part/13723/?ref=eda; Price: None; Availability: In Stock; Value: *; SnapEDA_Link: https://www.snapeda.com/parts/RUSBF075/TE%20Connectivity/view-part/13723/?ref=snap; Package: Radial TE Connectivity; MP: RUSBF075
IC1 = CP2102N-A02-GQFN28: USB Bridge, USB to UART USB 2.0 UART Interface 28-QFN (5x5); MF: Silicon Labs; MP: CP2102N-A02-GQFN28; Price: None; Purchase-URL: https://pricing.snapeda.com/search/part/CP2102N-A02-GQFN28/?ref=eda; Package: None; Availability: Warning; SnapEDA_Link: https://www.snapeda.com/parts/CP2102N-A02-GQFN28/Silicon%20Labs/view-part/4872321/?ref=snap; Check_prices: https://www.snapeda.com/parts/CP2102N-A02-GQFN28/Silicon%20Labs/view-part/4872321/?ref=eda; Value: *
J1 J4 = USB2066-05-RBHM-XX-STB-00-00-A_REVD: USB - mini B USB 2.0 Receptacle Connector 5 Position Surface Mount, Right Angle; MP: USB2066-05-RBHM-15-STB-00-00-A; MF: Global Connector Technology; Availability: Unavailable; SnapEDA_Link: https://www.snapeda.com/parts/USB2066-05-RBHM-15-STB-00-00-A/Global%20Connector%20Technology/view-part/105314/?ref=snap; Price: None; Package: None; Value: *
J2 = USB-B-S-X-X-TH: USB-B (USB TYPE-B) USB 2.0 Receptacle Connector 4 Position Through Hole, Right Angle; MP: USB-B-S-S-B-TH; MF: Samtec; Availability: Unavailable; Package: None; SnapEDA_Link: https://www.snapeda.com/parts/USB-B-S-S-B-TH/Samtec%20Inc./view-part/230656/?ref=snap; Value: *; Price: None; Toby_UK-Purchase-URL: https://snapeda.com/shop?store=Toby+UK&id=230656
J5 = USB4110-GF-A_REVB: USB-C (USB TYPE-C) USB 2.0 Receptacle Connector 24 (16+8 Dummy) Position Surface Mount, Right Angle; Through Hole; MF: GCT; Value: *; Price: None; Package: None; SnapEDA_Link: https://www.snapeda.com/parts/USB4110-GF-A/Global%20Connector%20Technology/view-part/4001167/?ref=snap; Availability: Warning; MP: USB4110-GF-A; Purchase-URL: https://pricing.snapeda.com/search/part/USB4110-GF-A/?ref=eda; Check_prices: https://www.snapeda.com/parts/USB4110-GF-A/Global%20Connector%20Technology/view-part/4001167/?ref=eda
J10 = ZF5S-24-01-T-WT: MF: Samtec; Availability: Unavailable; MP: ZF5S-24-01-T-WT; Package: None; Value: *; Price: None
L1 = AIMC-0201-12NJ-T: IND 12nH 0.15A 1000mâ„¦; MF: Abracon; Price: None; Check_prices: https://www.snapeda.com/parts/AIMC-0201-12NJ-T/Abracon/view-part/1579605/?ref=eda; Package: 0603 Abracon; SnapEDA_Link: https://www.snapeda.com/parts/AIMC-0201-12NJ-T/Abracon/view-part/1579605/?ref=snap; Value: *; MP: AIMC-0201-12NJ-T; Availability: In Stock
LED1-LED16 = ASMB-KTF0-0A306: Red, Green, Blue _RGB_ 620nm Red, 524nm Green, 471nm Blue LED Indication - Discrete 2V Red, 2.95V Green, 2.85V Blue 4-PLCC; MF: Broadcom Limited; Availability: Unavailable; Price: None; Package: PLCC-4 Broadcom; MP: ASMB-KTF0-0A306; Value: *; SnapEDA_Link: https://www.snapeda.com/parts/ASMB-KTF0-0A306/Broadcom%20Limited/view-part/2703546/?ref=snap
Q1-Q3 = MMBT3904,215: Bipolar (BJT) Transistor NPN 40V 200mA 300MHz 250mW Surface Mount TO-236AB; MF: Nexperia USA; SnapEDA_Link: https://www.snapeda.com/parts/MMBT3904,215/Nexperia/view-part/2399640/?ref=snap; Availability: Good; Price: None; Value: *; Check_prices: https://www.snapeda.com/parts/MMBT3904,215/Nexperia/view-part/2399640/?ref=eda; Purchase-URL: https://pricing.snapeda.com/search/part/MMBT3904,215/?ref=eda; MP: MMBT3904,215; Package: SOT23-3 Nexperia USA Inc.
R1-R16 R42 R46-R48 R50 R53 R109 R110 R112 = RES0603_100R: Standard 0805 Resistor, 5%, Thick Film; UA P/N: 13-0004; Value: 100R; Footprint: 0805; Type: THICK FILM
R17-R41 R43-R45 R49 R51 R52 R54-R108 R111 R113-R120 = RES0603_100R: Standard 0805 Resistor, 5%, Thick Film; Value: 100R; UA P/N: 13-0004; Footprint: 0805; Type: THICK FILM
RV1-RV16 = TC33X-2-501E: 500 Ohms 0.1W, 1/10W J Lead Surface Mount Trimmer Potentiometer Cermet 1 Turn Top Adjustment; MF: Bourns; Check_prices: https://www.snapeda.com/parts/TC33X-2-501E/Bourns/view-part/1440190/?ref=eda; Value: *; Purchase-URL: https://pricing.snapeda.com/search/part/TC33X-2-501E/?ref=eda; Package: SOD-23 Bourns; Price: None; MP: TC33X-2-501E; Availability: Good; SnapEDA_Link: https://www.snapeda.com/parts/TC33X-2-501E/Bourns/view-part/1440190/?ref=snap
SW1-SW33 = KMR731NGLFS: Tactile Switch SPST-NO Top Actuated Surface Mount; MF: C&K; MP: KMR731NGLFS; Purchase-URL: https://pricing.snapeda.com/search/part/KMR731NGLFS/?ref=eda; Package: None; SnapEDA_Link: https://www.snapeda.com/parts/KMR731NGLFS/C&K/view-part/700258/?ref=snap; Price: None; Availability: Good; Check_prices: https://www.snapeda.com/parts/KMR731NGLFS/C&K/view-part/700258/?ref=eda; Value: *
T1 = BSS138PS: Mosfet Array 2 N-Channel _Dual_ 60V 320mA 420mW Surface Mount 6-TSSOP; MF: Nexperia USA; Availability: Unavailable; MP: BSS138PS; Price: None; Value: *; SnapEDA_Link: https://www.snapeda.com/parts/BSS138PS/Nexperia%20USA%20Inc./view-part/1769543/?ref=snap; Package: SOT-363 Nexperia USA
U1 = PEC12R-4025F-S0024: Rotary Encoder Mechanical 24 Quadrature _Incremental_ Vertical; MF: Bourns; Package: None; Price: None; Availability: Unavailable; MP: PEC12R-4025F-S0024; SnapEDA_Link: https://www.snapeda.com/parts/PEC12R-4025F-S0024/Bourns%20-%20J.W.%20Miller/view-part/353124/?ref=snap; Value: *
U2 = NC7NZ04K8X_1: UHS Inverter; Package: None; Price: None; Value: *; MP: NC7NZ04K8X; Availability: Unavailable
U3 U4 = SN74LVC245APWG4: Octal Bus Transceiver With 3-State Outputs 20-TSSOP -40 to 125; MF: Texas Instruments; Value: *; Price: None; Package: TSSOP-20 Texas Instruments; Purchase-URL: https://pricing.snapeda.com/search/part/SN74LVC245APWG4/?ref=eda; Availability: In Stock; MP: SN74LVC245APWG4
Y1 = ABM8G-20.000MHZ-4Y-T3: Crystal 20MHz Ã‚Â±20ppm (Tol) Ã‚Â±30ppm (Stability) 18pF FUND 80Ohm 4-Pin Mini-CSMD T/R; Package: None; Price: None; Value: *; MP: ABM8G-20.000MHZ-4Y-T3; Availability: Unavailable; Farnell: 2467844
FID1 FID2 = FIDUCIAL: Value: FIDUCIAL
H1-H4 = 3.0MM HOLE+PAD: Value: 3.0MM HOLE+PAD
J6 J8 J11 J13 = TSW-104-26-F-S: Package: None; Price: None; Value: *; MP: TSW-104-26-F-S; Availability: Unavailable
J7 = TSW-105-23-L-S-LL: Package: None; Price: None; Value: *; MP: TSW-105-23-L-S-LL; Availability: Unavailable